# EAGLE design smartbbq (EAGLE 6.6.0)
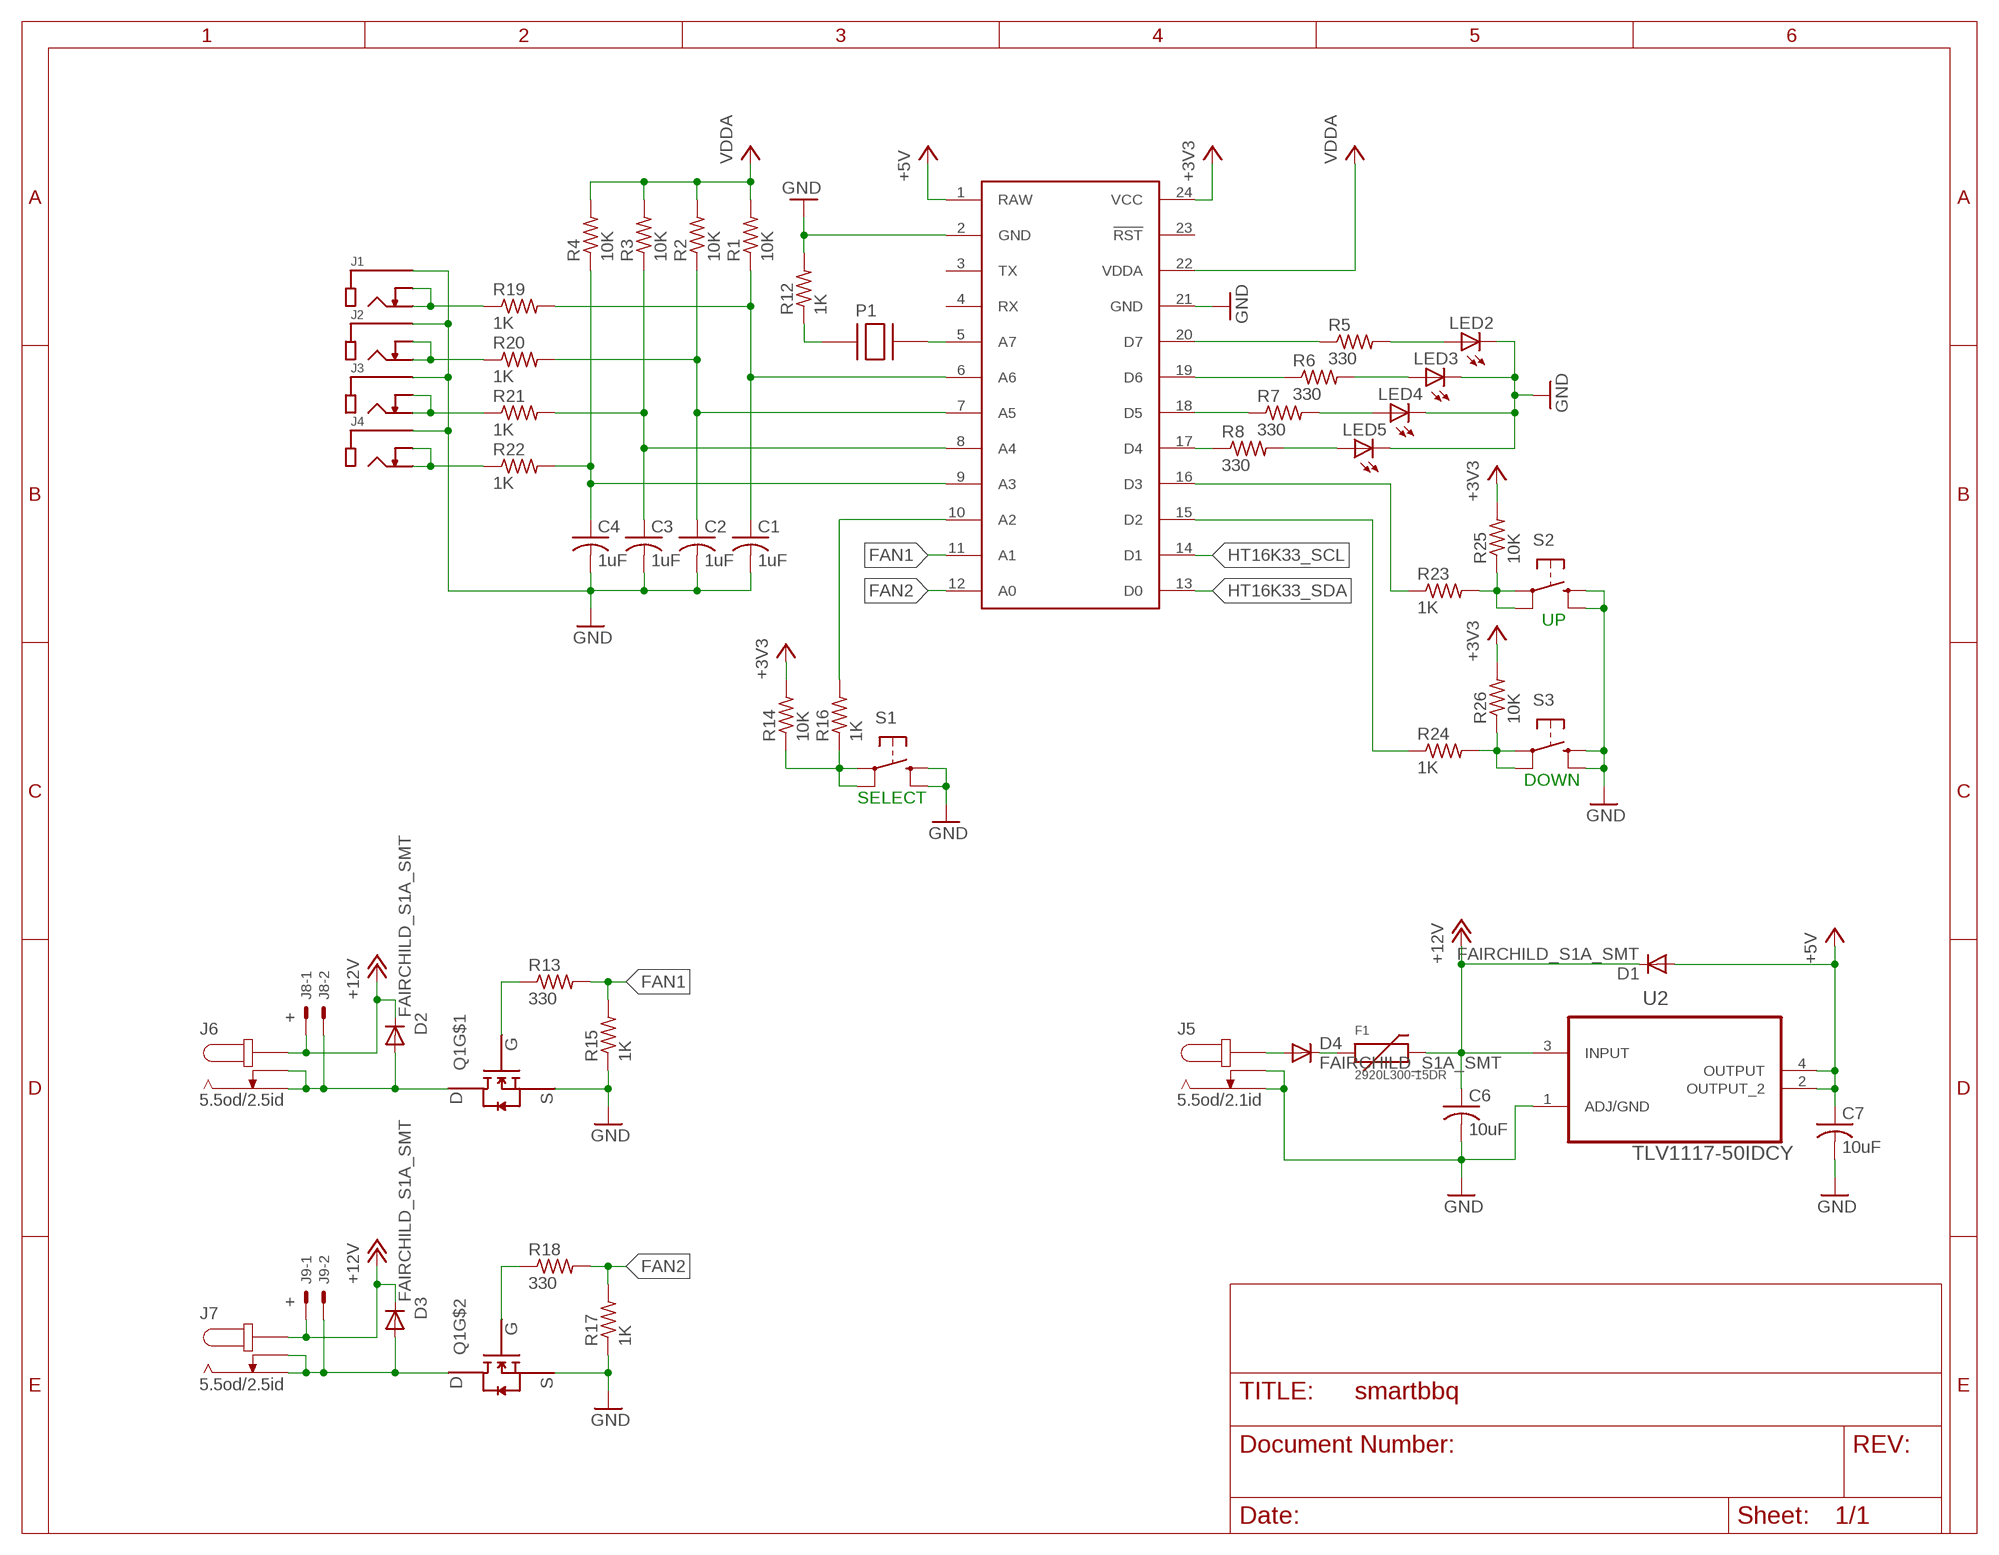
[diagram p0: schematic, sheet 1, part 1 of 2]
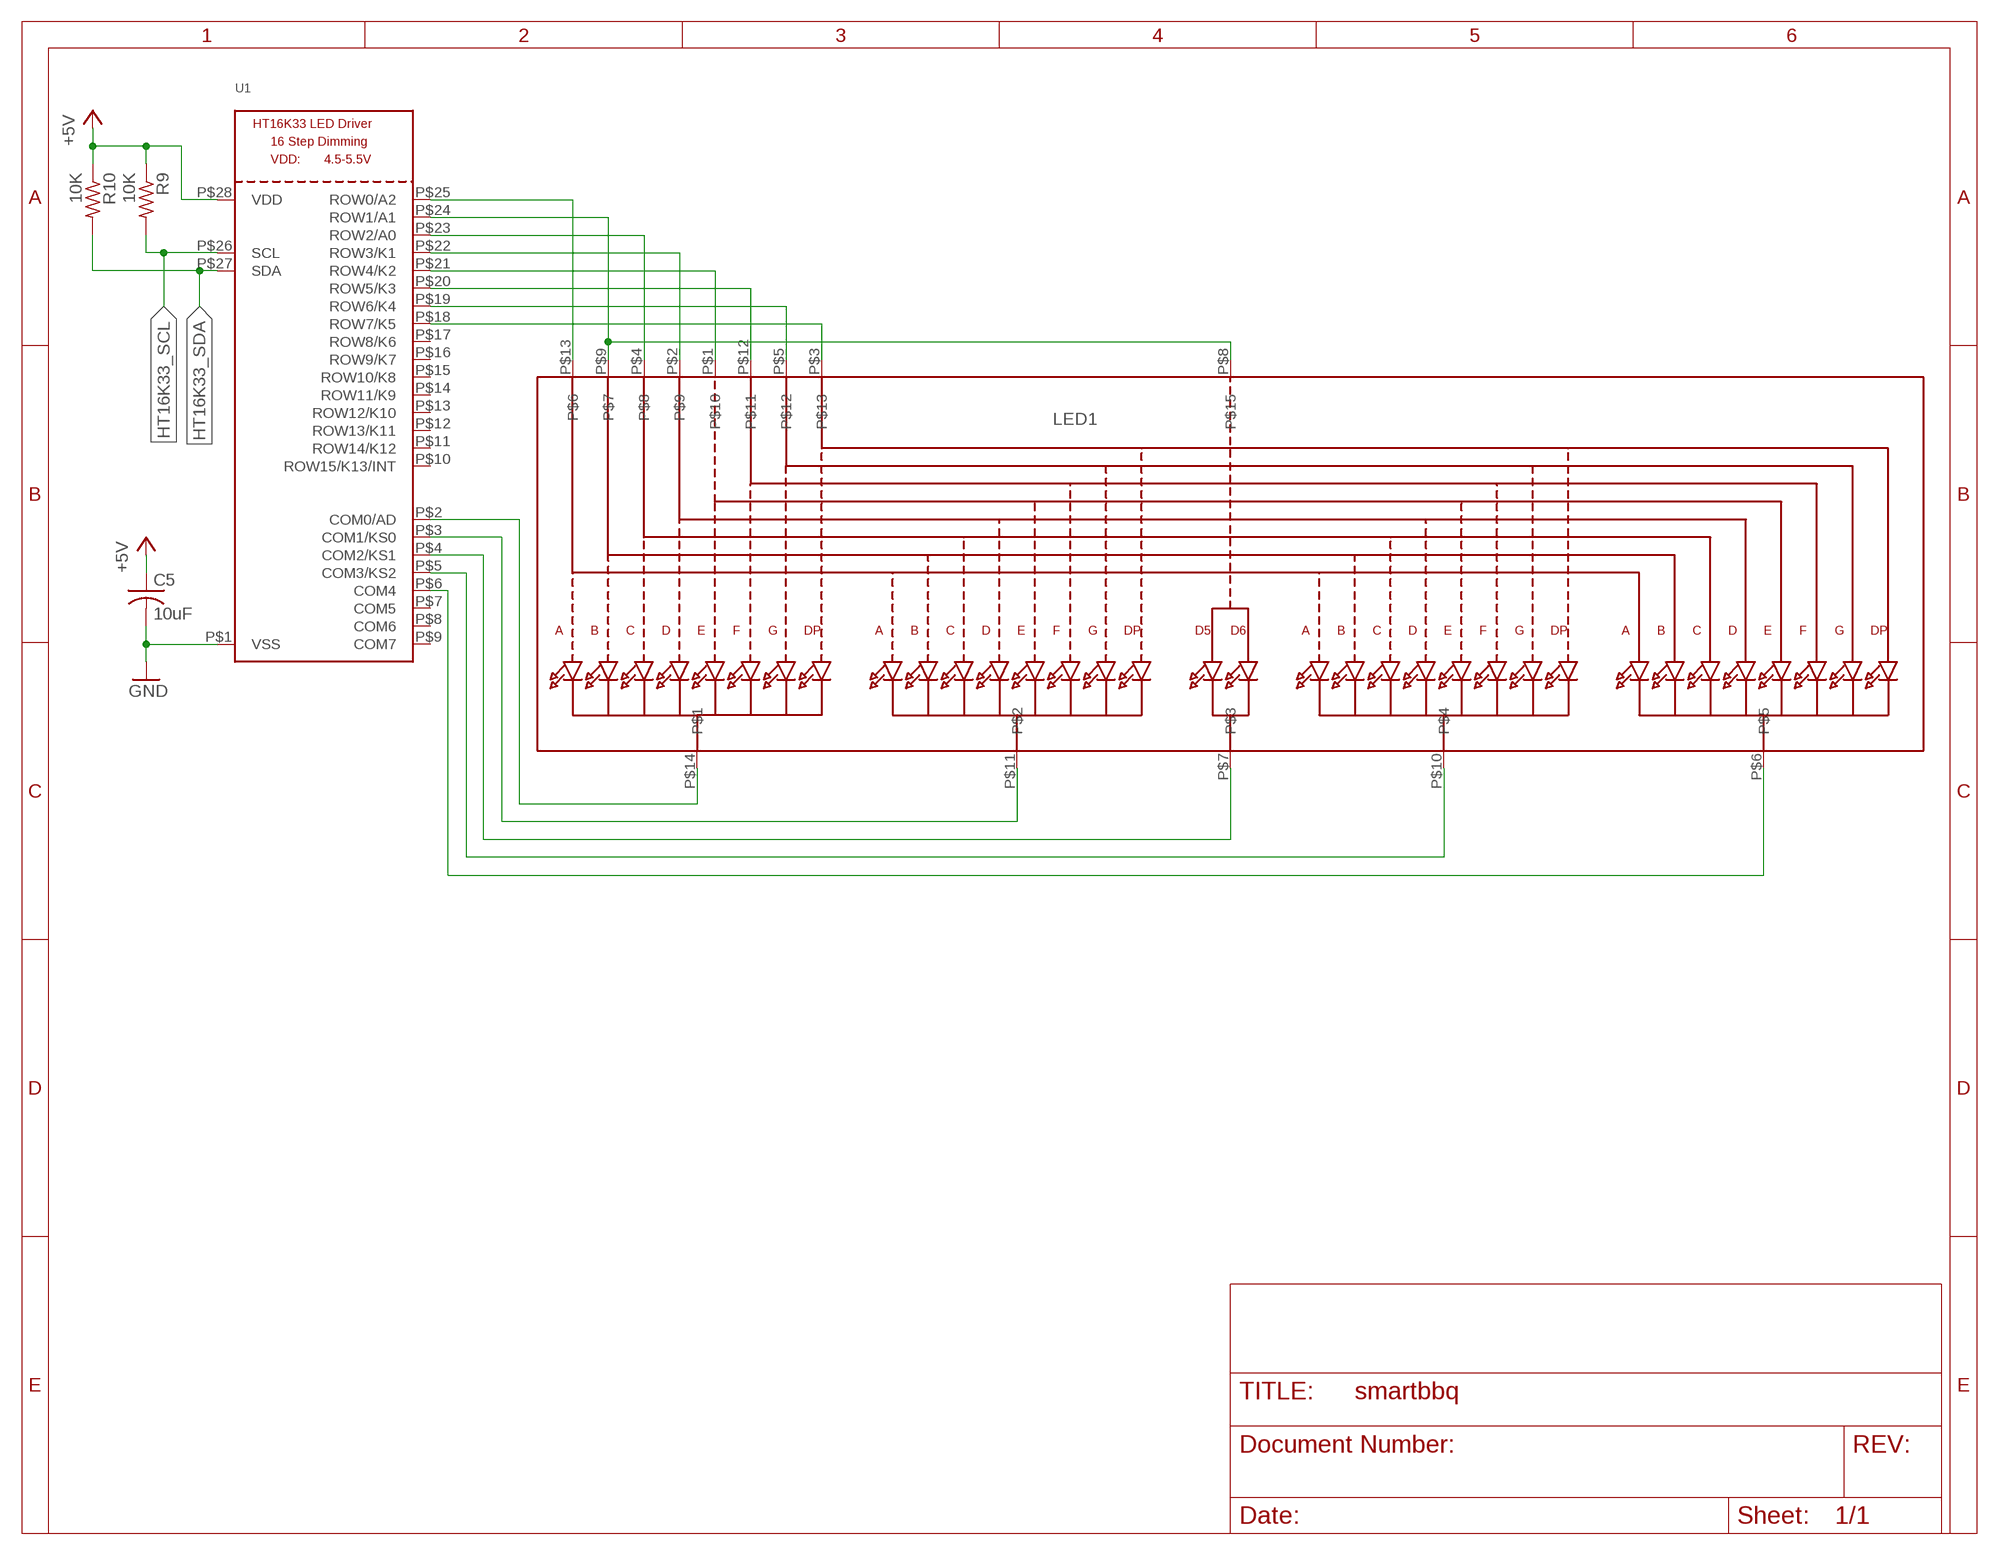
[diagram p1: schematic, sheet 1, part 2 of 2]

## Parts
C1  1uF  C-USC0805  [C0805]
C2  1uF  C-USC0805  [C0805]
C3  1uF  C-USC0805  [C0805]
C4  1uF  C-USC0805  [C0805]
C5  10uF  C-USC0805  [C0805]
C6  10uF  C-USC0805  [C0805]
C7  10uF  C-USC0805  [C0805]
D1  FAIRCHILD_S1A_SMT  [FAIRCHILD_S1A_SMT]
D2  FAIRCHILD_S1A_SMT  [FAIRCHILD_S1A_SMT]
D3  FAIRCHILD_S1A_SMT  [FAIRCHILD_S1A_SMT]
D4  FAIRCHILD_S1A_SMT  [FAIRCHILD_S1A_SMT]
F1  2920L300-15DR  [2920L300-15DR]
J1  MJ_2523_SMT  [MJ_2523_SMT]
J2  MJ_2523_SMT  [MJ_2523_SMT]
J3  MJ_2523_SMT  [MJ_2523_SMT]
J4  MJ_2523_SMT  [MJ_2523_SMT]
J5  5.5od/2.1id  PJ_002AH_SMT  [PJ_002AH_SMT]
J6  5.5od/2.5id  PJ_002AH_SMT  [PJ_002AH_SMT]
J7  5.5od/2.5id  PJ_002AH_SMT  [PJ_002AH_SMT]
J8  +  22-05-7028-02  [7395-02]
J9  +  22-05-7028-02  [7395-02]
LED1  DISP_SEGMENT_4DIGIT_BL-Q56C43  [SEGMENT-BL-Q56C43]
LED2  LEDCHIPLED_0805  [CHIPLED_0805]
LED3  LEDCHIPLED_0805  [CHIPLED_0805]
LED4  LEDCHIPLED_0805  [CHIPLED_0805]
LED5  LEDCHIPLED_0805  [CHIPLED_0805]
P1  CMT_1603_SMT  [CMT_1603_SMT]
Q1  SSM6N58NU  [SSM6N58NU]
R1  10K  R-US_R0805  [R0805]
R2  10K  R-US_R0805  [R0805]
R3  10K  R-US_R0805  [R0805]
R4  10K  R-US_R0805  [R0805]
R5  330  R-US_R0805  [R0805]
R6  330  R-US_R0805  [R0805]
R7  330  R-US_R0805  [R0805]
R8  330  R-US_R0805  [R0805]
R9  10K  R-US_R0805  [R0805]
R10  10K  R-US_R0805  [R0805]
R12  1K  R-US_R0805  [R0805]
R13  330  R-US_R0805  [R0805]
R14  10K  R-US_R0805  [R0805]
R15  1K  R-US_R0805  [R0805]
R16  1K  R-US_R0805  [R0805]
R17  1K  R-US_R0805  [R0805]
R18  330  R-US_R0805  [R0805]
R19  1K  R-US_R0805  [R0805]
R20  1K  R-US_R0805  [R0805]
R21  1K  R-US_R0805  [R0805]
R22  1K  R-US_R0805  [R0805]
R23  1K  R-US_R0805  [R0805]
R24  1K  R-US_R0805  [R0805]
R25  10K  R-US_R0805  [R0805]
R26  10K  R-US_R0805  [R0805]
S1  PANASONIC-EVQ  [PANASONIC-EVQ]
S2  PANASONIC-EVQ  [PANASONIC-EVQ]
S3  PANASONIC-EVQ  [PANASONIC-EVQ]
SPARK  SPARK_CORECORE  [SPARK_CORE]
U1  HT16K33_SOP28  [SOP28_300MIL]
U2  TLV1117-50IDCY  TLV1117-33IDCY  [SOT230P700X180-4N]

## Nets
+3V3: R14.2 R25.2 R26.2 SPARK.24(VCC)
+5V [supply1]: C5.1 C7.1 D1.P$1(A) R9.1 R10.1 SPARK.1(RAW) U1.P$28(VDD) U2.2(OUTPUT_2) U2.4(OUTPUT)
+12V [supply1]: C6.1 D1.P$2(C) D2.P$2(C) D3.P$2(C) F1.P$2 J6.P$1 J6.P$4 J7.P$1 J7.P$4 J8.1 J9.1 U2.3(INPUT)
A0: LED1.P$4 U1.P$23(ROW2/A0)
A1: LED1.P$8 LED1.P$9 U1.P$24(ROW1/A1)
FAN1: R13.2 R15.2 SPARK.11(A1)
FAN2: R17.2 R18.2 SPARK.12(A0)
GND [supply1]: C1.2 C2.2 C3.2 C4.2 C5.2 C6.2 C7.2 J1.P$1 J2.P$1 J3.P$1 J4.P$1 J5.P$2 J5.P$3 LED2.C LED3.C LED4.C LED5.C Q1.P$1 Q1.P$4 R12.2 R15.1 R17.1 S1.P$3 S1.P$4 S2.P$3 S2.P$4 S3.P$3 S3.P$4 SPARK.2(GND) SPARK.21(GND) U1.P$1(VSS) U2.1(ADJ/GND)
HT16K33_SCL: R9.2 SPARK.14(D1) U1.P$26(SCL)
HT16K33_SDA: R10.2 SPARK.13(D0) U1.P$27(SDA)
N$1: LED1.P$14 U1.P$2(COM0/AD)
N$2: LED1.P$11 U1.P$3(COM1/KS0)
N$3: LED1.P$10 U1.P$5(COM3/KS2)
N$4: LED1.P$7 U1.P$4(COM2/KS1)
N$5: R8.1 SPARK.17(D4)
N$6: R7.1 SPARK.18(D5)
N$7: R6.1 SPARK.19(D6)
N$8: R5.1 SPARK.20(D7)
N$9: LED2.A R5.2
N$10: LED3.A R6.2
N$11: LED4.A R7.2
N$12: LED5.A R8.2
N$13: R24.1 SPARK.15(D2)
N$14: R23.1 SPARK.16(D3)
N$15: C1.1 R1.1 R19.2 SPARK.6(A6)
N$16: R16.2 SPARK.10(A2)
N$17: C2.1 R2.1 R20.2 SPARK.7(A5)
N$18: C3.1 R3.1 R21.2 SPARK.8(A4)
N$19: C4.1 R4.1 R22.2 SPARK.9(A3)
N$20: LED1.P$12 U1.P$20(ROW5/K3)
N$21: LED1.P$5 U1.P$19(ROW6/K4)
N$22: LED1.P$6 U1.P$6(COM4)
N$23: LED1.P$2 U1.P$22(ROW3/K1)
N$24: LED1.P$1 U1.P$21(ROW4/K2)
N$25: LED1.P$13 U1.P$25(ROW0/A2)
N$27: LED1.P$3 U1.P$18(ROW7/K5)
N$28: P1.P$1 R12.1
N$29: P1.P$2 SPARK.5(A7)
N$30 [supply1]: D3.P$1(A) J7.P$2 J7.P$3 J9.2 Q1.P$3
N$31: Q1.P$5 R18.1
N$32 [supply1]: D2.P$1(A) J6.P$2 J6.P$3 J8.2 Q1.P$6
N$33 [supply1]: D4.P$2(C) F1.P$1
N$34: Q1.P$2 R13.1
N$35: R14.1 R16.1 S1.P$1 S1.P$2
N$36: J4.P$2 J4.P$3 R22.1
N$37: J3.P$2 J3.P$3 R21.1
N$38: J2.P$2 J2.P$3 R20.1
N$39: J1.P$2 J1.P$3 R19.1
N$40: R23.2 R25.1 S2.P$1 S2.P$2
N$41 [supply1]: D4.P$1(A) J5.P$1 J5.P$4
N$42: R24.2 R26.1 S3.P$1 S3.P$2
VCC: R1.2 R2.2 R3.2 R4.2 SPARK.22(VDDA) ; supply symbol labelled VDDA
Unconnected: SPARK.3(TX) SPARK.4(RX) SPARK.23(!RST) U1.P$7(COM5) U1.P$8(COM6) U1.P$9(COM7) U1.P$10(ROW15/K13/INT) U1.P$11(ROW14/K12) U1.P$12(ROW13/K11) U1.P$13(ROW12/K10) U1.P$14(ROW11/K9) U1.P$15(ROW10/K8) U1.P$16(ROW9/K7) U1.P$17(ROW8/K6)

## Notes on the sheet
- UP
- DOWN
- SELECT

## Library data of the parts
C1-C7 = rcl:C-US: CAPACITOR, American symbol
D1-D4 = engirati:FAIRCHILD_S1A_SMT
F1 = engirati:2920L300-15DR
J1-J4 = engirati:MJ_2523_SMT
J5-J7 = engirati:PJ_002AH_SMT: MODEL: PJ-002AH-SMT or PJ-002BH-SMT DESCRIPTION: DC POWER JACK FEATURES: high current rating: 5A internal switch RoHS compliant
J8 J9 = con-molex:22-?-02: CONNECTOR wire to board 2.54 mm (.1 inch) pitch header; OC_FARNELL: 9731601; OC_NEWARK: unknown
LED1 = microbuilder:DISP_SEGMENT_4DIGIT_BL-Q56C43
LED2-LED5 = led:LED: LED OSRAM: - CHIPLED LG R971, LG N971, LY N971, LG Q971, LY Q971, LO R971, LY R971 LH N974, LH R974 LS Q976, LO Q976, LY Q976 LO Q996 - Hyper CHIPLED LW Q18S LB Q993, LB Q99A, LB R99A - SideLED LS A670, LO A670, LY A670, LG A670, LP A670 LB A673, LV A673, LT A673, LW A673 LH A674 LY A675 LS A676, LA A676, LO A676, LY A676, LW A676 LS A679, LY A679, LG A679 - Hyper Micro SIDELED® LS Y876, LA Y876, LO Y876, LY Y876 LT Y87S - SmartLED LW L88C, LW L88S LB L89C, LB L89S, LG L890 LS L89K, LO L89K, LY L89K LS L896, LA L896, LO L896, LY L896 - TOPLED LS T670, LO T670, LY T670, LG T670, LP T670 LSG T670, LSP T670, LSY T670, LOP T670, LYG T670 LG T671, LOG T671, LSG T671 LB T673, LV T673, LT T673, LW T673 LH T674 LS T676, LA T676, LO T676, LY T676, LB T676, LH T676, LSB T676, LW T676 LB T67C, LV T67C, LT T67C, LS T67K, LO T67K, LY T67K, LW E67C LS E67B, LA E67B, LO E67B, LY E67B, LB E67C, LV E67C, LT E67C LW T67C LS T679, LY T679, LG T679 LS T770, LO T770, LY T770, LG T770, LP T770 LB T773, LV T773, LT T773, LW T773 LH T774 LS E675, LA E675, LY E675, LS T675 LS T776, LA T776, LO T776, LY T776, LB T776 LHGB T686 LT T68C, LB T68C - Hyper Mini TOPLED® LB M676 - Mini TOPLED Santana® LG M470 LS M47K, LO M47K, LY M47K Source: http://www.osram.convergy.de LUXEON: - LUMILED® LXK2-PW12-R00, LXK2-PW12-S00, LXK2-PW14-U00, LXK2-PW14-V00 LXK2-PM12-R00, LXK2-PM12-S00, LXK2-PM14-U00 LXK2-PE12-Q00, LXK2-PE12-R00, LXK2-PE12-S00, LXK2-PE14-T00, LXK2-PE14-U00 LXK2-PB12-K00, LXK2-PB12-L00, LXK2-PB12-M00, LXK2-PB14-N00, LXK2-PB14-P00, LXK2-PB14-Q00 LXK2-PR12-L00, LXK2-PR12-M00, LXK2-PR14-Q00, LXK2-PR14-R00 LXK2-PD12-Q00, LXK2-PD12-R00, LXK2-PD12-S00 LXK2-PH12-R00, LXK2-PH12-S00 LXK2-PL12-P00, LXK2-PL12-Q00, LXK2-PL12-R00 Source: www.luxeon.com KINGBRIGHT: KA-3528ASYC Source: www.kingbright.com
P1 = engirati:CMT_1603_SMT
Q1 = engirati:SSM6N58NU
R1-R10 R12-R26 = rcl:R-US_: RESISTOR, American symbol
S1-S3 = engirati:PANASONIC-EVQ
SPARK = Spark:SPARK_CORE
U1 = microbuilder:HT16K33_SOP28
U2 = Texas Instruments_By_element14_Batch_1:TLV1117-33IDCY: V REG, LDO, 3.3V, 0.8A; MPN: TLV1117-33IDCY; OC_FARNELL: 1703385; OC_NEWARK: 67K8522; PACKAGE: SOT-223-3; SUPPLIER: TEXAS INSTRUMENTS

## Net classes
0 default: width 0.254 mm, drill 0.203 mm, clearance 0.203 mm
1 supply1: width 0.457 mm, drill 0.508 mm, clearance 0.203 mm

## Board
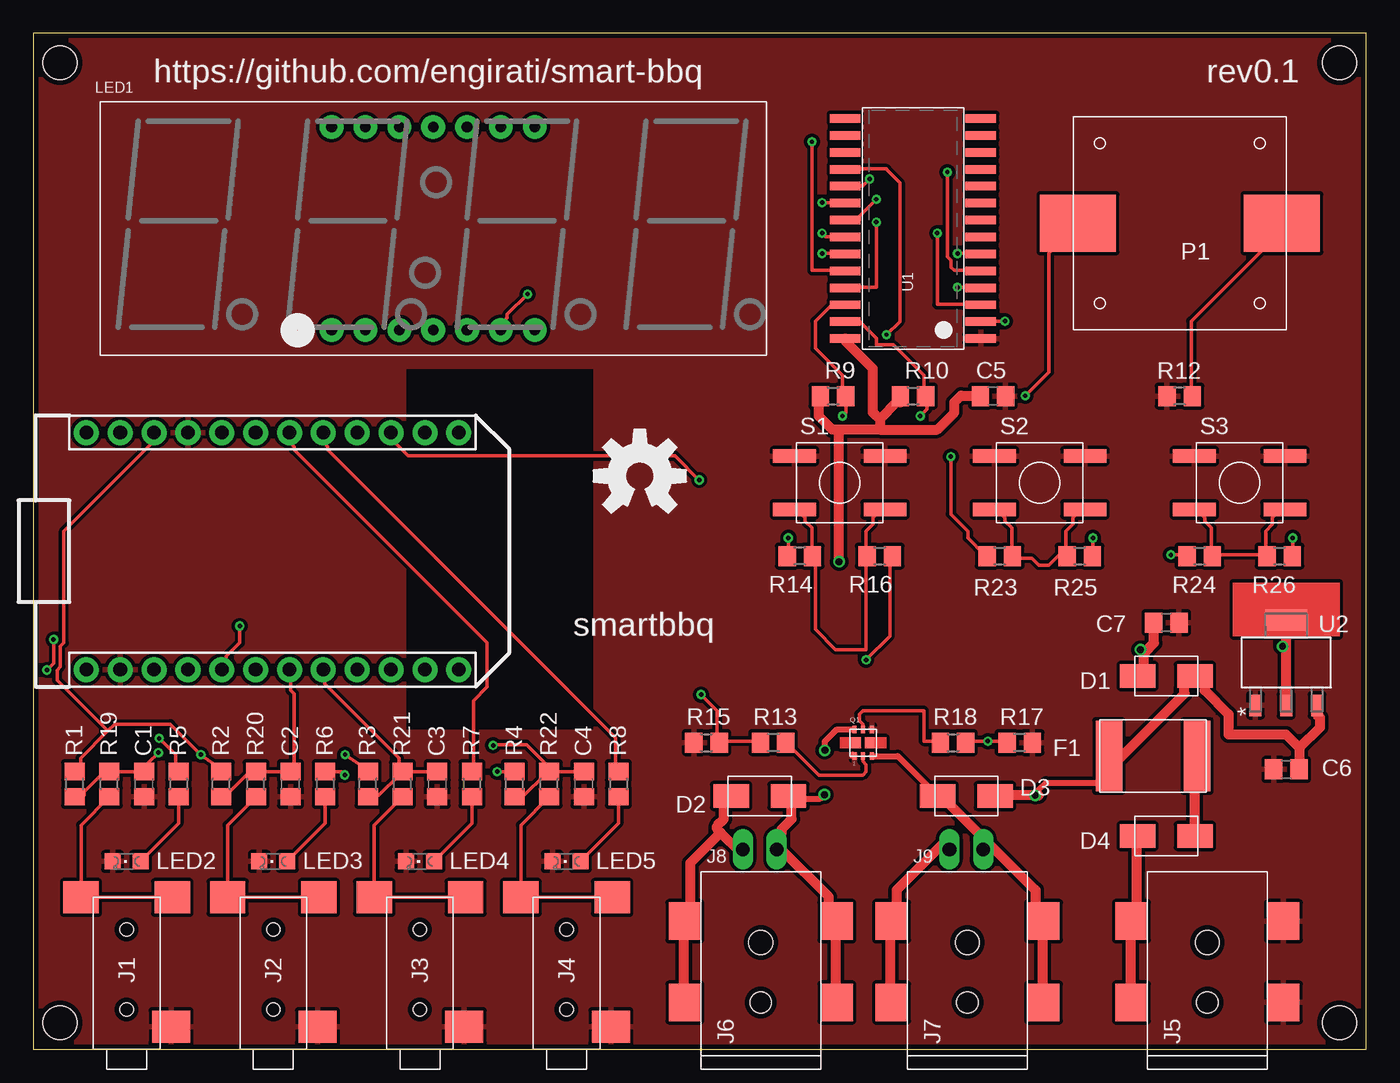
[diagram p2: board, top side]
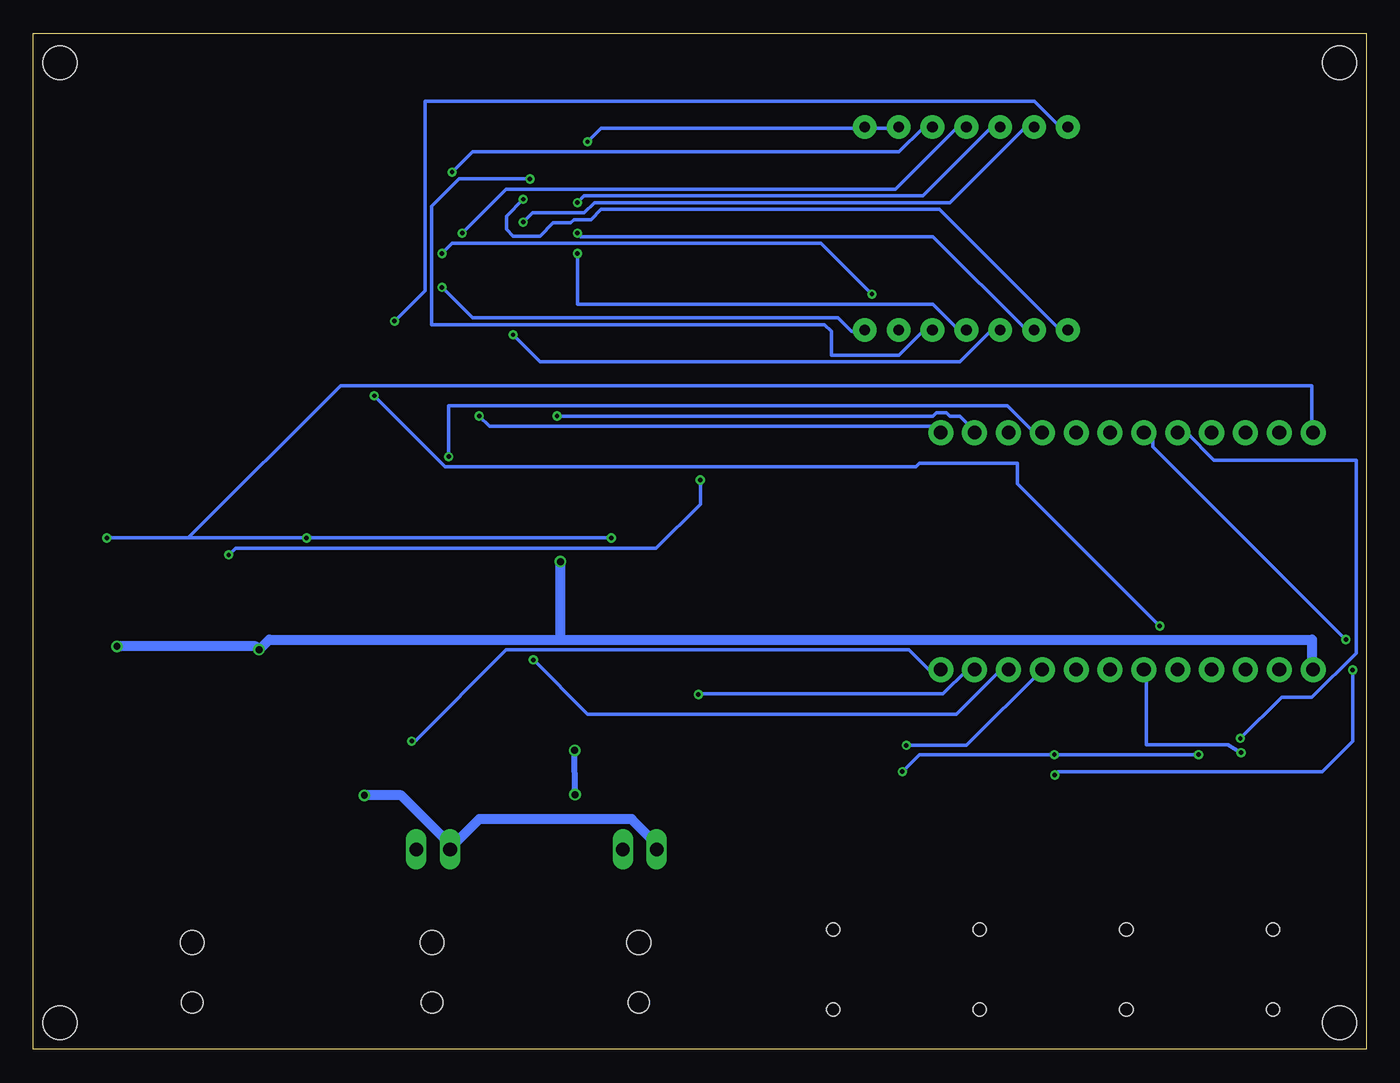
[diagram p3: board, bottom side, seen from below]

Size 100 x 76.2 mm. Coordinates in mm from the lower left corner, seen from the top.
Outline: 0,0 100,0 100,76.2 0,76.2 0,0
Copper layers (1*16): Top 0.0356mm / dielectric 1.5011mm / Bottom 0.0356mm
Design rules "LaenPCBOrder": minimum track width 6mil, minimum drill 13mil, track to track 6mil, track to pad 6mil, pad to pad 6mil, via to via 6mil, smd to smd 6mil, copper to edge 15mil, drill to drill 6mil, minimum pad ring 7mil, minimum via ring 7mil, stop-mask expansion 3mil, vias tented up to drill 0mil, thermal gap 10mil
Holes 2.54 mm at 2,2 2,74 98,74 98,2
tRestrict: area 28,24 to 42,51

### Footprints (pad centres in the part's own frame; a part is rotated, then mirrored left to right if it is on the bottom)
C0805 = smd 1.3 x 1.5: 1 -0.95,0; 2 0.95,0
FAIRCHILD_S1A_SMT = smd 2.65 x 1.75: P$1 -2.15,0; P$2 2.15,0
2920L300-15DR = smd 2 x 5.3: P$1 -3.3,0; P$2 3.3,0
MJ_2523_SMT = smd 2.4 x 2.85: P$1 1.7,-0.825 | smd 2.4 x 2.65: P$2 11.4,-0.925; P$3 11.4,5.925 | hole 1: 3,2.5; 9,2.5
PJ_002AH_SMT = smd 2.8 x 2.4: P$1 -1.985,5.615; P$2 -1.985,-5.785; P$3 4.115,-5.785; P$4 4.115,5.615 | hole 1.6: -1.985,-0.085 | hole 1.8: 2.515,-0.085
7395-02 = drill 1.016 long: 1 1.27,0; 2 -1.27,0
SEGMENT-BL-Q56C43 = drill 0.8 pad 1.778: P$1 -7.62,-7.62; P$2 -5.08,-7.62; P$3 -2.54,-7.62; P$4 0,-7.62; P$5 2.54,-7.62; P$6 5.08,-7.62; P$7 7.62,-7.62; P$8 7.62,7.62; P$9 5.08,7.62; P$10 2.54,7.62; P$11 0,7.62; P$12 -2.54,7.62; P$13 -5.08,7.62; P$14 -7.62,7.62
CHIPLED_0805 = smd 1.2 x 1.2: A 0,-1.05; C 0,1.05
CMT_1603_SMT = smd 5.7 x 4.3: P$1 -7.67,0.045; P$2 7.63,0.045
SSM6N58NU = smd 0.3 x 0.55: P$1 -0.65,-1; P$2 0,-1; P$3 0.65,-1; P$4 0.65,1; P$5 0,1; P$6 -0.65,1 | smd 0.75 x 0.8: P$7 -0.525,0; P$8 0.525,0
R0805 = smd 1.3 x 1.5: 1 -0.95,0; 2 0.95,0
PANASONIC-EVQ = smd 3.2 x 1: P$1 -3.4,-2; P$2 3.4,-2; P$3 -3.4,2; P$4 3.4,2
SPARK_CORE = drill 1.016 pad 1.88: 1 -8.89,13.97; 2 -8.89,11.43; 3 -8.89,8.89; 4 -8.89,6.35; 5 -8.89,3.81; 6 -8.89,1.27; 7 -8.89,-1.27; 8 -8.89,-3.81; 9 -8.89,-6.35; 10 -8.89,-8.89; 11 -8.89,-11.43; 12 -8.89,-13.97; 13 8.89,-13.97; 14 8.89,-11.43; 15 8.89,-8.89; 16 8.89,-6.35; 17 8.89,-3.81; 18 8.89,-1.27; 19 8.89,1.27; 20 8.89,3.81; 21 8.89,6.35; 22 8.89,8.89; 23 8.89,11.43; 24 8.89,13.97
SOP28_300MIL = smd 0.635 x 2.286: P$1 -8.255,-5.08; P$2 -6.985,-5.08; P$3 -5.715,-5.08; P$4 -4.445,-5.08; P$5 -3.175,-5.08; P$6 -1.905,-5.08; P$7 -0.635,-5.08; P$8 0.635,-5.08; P$9 1.905,-5.08; P$10 3.175,-5.08; P$11 4.445,-5.08; P$12 5.715,-5.08; P$13 6.985,-5.08; P$14 8.255,-5.08; P$15 8.255,5.08; P$16 6.985,5.08; P$17 5.715,5.08; P$18 4.445,5.08; P$19 3.175,5.08; P$20 1.905,5.08; P$21 0.635,5.08; P$22 -0.635,5.08; P$23 -1.905,5.08; P$24 -3.175,5.08; P$25 -4.445,5.08; P$26 -5.715,5.08; P$27 -6.985,5.08; P$28 -8.255,5.08
SOT230P700X180-4N = smd 1.626 x 0.889: 1 -3.2,2.311; 2 -3.2,0; 3 -3.2,-2.311 | smd 1.626 x 3.175: 4 3.2,0

### Placement (x,y rotation side)
C1  8.3,19.9 270 top
C2  19.3,19.9 270 top
C3  30.3,19.9 270 top
C4  41.3,19.9 270 top
C5  72,49 0 top
C6  94,21 180 top
C7  85,32 0 top
D1  85,28 0 top
D2  54.5,19 180 top
D3  70,19 0 top
D4  85,16 0 top
F1  84,22 180 top
J1  9.5,0 90 top
J2  20.5,0 90 top
J3  31.5,0 90 top
J4  42.5,0 90 top
J5  88,5.5 90 top
J6  54.5,5.5 90 top
J7  70,5.5 90 top
J8  54.5,15 180 top
J9  70,15 180 top
LED1  30,61.56 0 top
LED2  7,14.1 90 top
LED3  18,14.1 90 top
LED4  29,14.1 90 top
LED5  40,14.1 90 top
P1  86,62 180 top
Q1  62.25,23 0 top
R1  3.1,19.9 90 top
R2  14.1,19.9 90 top
R3  25.1,19.9 90 top
R4  36.1,19.9 90 top
R5  10.9,19.9 270 top
R6  21.9,19.9 270 top
R7  32.9,19.9 270 top
R8  43.9,19.9 270 top
R9  60,49 0 top
R10  66,49 0 top
R12  86,49 180 top
R13  55.5,23 180 top
R14  57.5,37 180 top
R15  50.5,23 0 top
R16  63.5,37 0 top
R17  74,23 180 top
R18  69,23 0 top
R19  5.7,19.9 90 top
R20  16.7,19.9 90 top
R21  27.7,19.9 90 top
R22  38.7,19.9 90 top
R23  72.5,37 0 top
R24  87.5,37 0 top
R25  78.5,37 0 top
R26  93.5,37 0 top
S1  60.5,42.5 0 top
S2  75.5,42.5 0 top
S3  90.5,42.5 0 top
SPARK  17.95,37.37 90 top
U1  66,61.56 90 top
U2  94,29 90 top
U$1  [OSHW-LOGO-L]  45.5,43 0 top

### Tracks (layer width: path | path; a pad name or v marks a point on that pad's centre or on a via)
+3V3  (via drill 0.33)
  Top 0.254: v56.64,38.35 56.64,37.08 R14.2 | v79.5,38.35 79.5,37.08 R25.2 | v94.49,38.35 94.49,37.08 R26.2
  Bottom 0.254: v56.64,38.35 v79.5,38.35 88.39,38.35 | 88.39,38.35 v94.49,38.35 | 88.39,38.35 76.96,49.78 4.06,49.78 4.06,46.48 SPARK.24
+5V  (via drill 0.51)
  Top 0.762: 63.5,46.48 60.45,46.48 | 60.45,46.48 59.94,46.48 58.93,47.5 58.93,48.77 R9.1 | 63.5,47.24 63.5,46.48 | 63.5,47.24 64.77,48.51 65.02,48.51 65.02,48.77 R10.1 | 63.5,46.48 67.82,46.48 69.09,47.75 69.09,48.51 69.6,49.02 70.87,49.02 C5.1 | U1.P$28 60.96,53.09 62.99,51.05 62.99,47.75 63.5,47.24 | 93.98,30.23 93.98,32 U2.4 | 93.98,30.23 93.98,25.91 U2.2 | 83.31,29.72 84.07,30.48 84.07,31.75 C7.1 | 83.31,29.72 83.31,28.45 83.06,28.19 D1.P$1 | v83.06,29.97 83.31,29.72 | v93.73,30.23 93.98,30.23 | v60.45,36.58 60.45,46.48
  Bottom 0.762: 60.45,30.73 82.3,30.73 v83.06,29.97 83.31,30.23 v93.73,30.23 | 60.45,30.73 4.06,30.73 4.06,28.7 SPARK.1 | 60.45,30.73 v60.45,36.58
+12V  (via drill 0.51)
  Top 0.457: 75.42,19.05 75.42,19.42 76,20 80.71,20 80.77,20.07
  Top 0.762: 95,22.61 95,21.08 C6.1 | 95,22.61 96.52,24.13 96.52,24.89 96.27,25.15 96.27,25.65 U2.3 | 75.42,19.05 v75.17,19.05 72.39,19.05 D3.P$2 | 80.77,20.07 80.77,21.84 F1.P$2 81.03,21.34 86.36,26.67 86.36,27.94 87.12,27.94 D1.P$2 87.38,28.19 87.88,27.69 87.88,26.92 89.66,25.15 89.66,23.62 93.98,23.62 95,22.61 | J7.P$1 64.26,3.56 64.26,9.4 J7.P$4 64.52,9.91 64.77,10.16 64.77,11.94 68.58,15.75 68.83,15.75 68.83,15.24 J9.1 | J6.P$1 48.77,3.56 48.77,9.4 J6.P$4 49.02,9.91 49.28,10.16 49.28,13.97 51.56,16.26 | 51.56,16.26 53.09,14.73 53.34,14.73 53.34,14.99 J8.1 | 51.56,16.26 51.31,16.51 51.31,16.76 51.82,17.27 51.82,18.29 52.32,18.8 D2.P$2
  Bottom 0.762: J8.1 53.09,15.24 55.12,17.27 66.55,17.27 68.58,15.24 J9.1 68.83,15.49 72.39,19.05 v75.17,19.05
A0  (via drill 0.33)
  Top 0.254: v59.18,59.69 60.71,59.69 U1.P$23
  Bottom 0.254: v59.18,59.69 59.18,55.88 32.51,55.88 30.48,53.85 30.23,53.85 LED1.P$4
A1  (via drill 0.33)
  Top 0.254: v58.42,68.07 58.42,58.42 60.71,58.42 U1.P$24
  Bottom 0.254: v58.42,68.07 57.4,69.09 37.85,69.09 LED1.P$8 37.59,69.09 35.31,69.09 LED1.P$9
FAN1  (via drill 0.33)
  Top 0.254: R13.2 54.36,23.11 51.56,23.11 R15.2 51.31,23.11 51.31,25.4 v50.1,26.61
  Bottom 0.254: v50.1,26.61 50.04,26.67 31.75,26.67 29.97,28.45 29.46,28.45 SPARK.11
FAN2  (via drill 0.33)
  Top 0.254: R17.2 72.9,23.11 v71.61,23.11 70.1,23.11 R18.2
  Bottom 0.254: SPARK.12 32,28.45 32.77,28.45 34.29,29.97 64.52,29.97 71.37,23.11 v71.61,23.11
GND
  Top 0.457: Q1.P$1 61.47,22.1 61.47,22 | SPARK.21 11.68,45.72 11.55,45.72
  pour Top: -1,77 -1,-1 101,-1 101,77
HT16K33_SCL  (via drill 0.33)
  Top 0.254: U1.P$26 60.71,55.88 59.94,55.88 58.67,54.61 58.67,52.58 60.71,50.55 60.71,49.02 R9.2 60.96,48.77 60.96,47.75 v60.71,47.5
  Bottom 0.254: v60.71,47.5 32.51,47.5 32.26,47.75 31.5,47.75 31.24,47.5 30.48,47.5 29.46,46.48 SPARK.14
HT16K33_SDA  (via drill 0.33)
  Top 0.254: U1.P$27 60.96,54.61 61.98,54.61 63.25,53.34 63.25,52.83 64.52,52.83 66.8,50.55 66.8,49.02 R10.2 67.06,48.77 67.06,48.01 v66.55,47.5
  Bottom 0.254: v66.55,47.5 65.79,46.74 32.26,46.74 32,46.48 SPARK.13
N$1  (via drill 0.33)
  Top 0.254: v72.9,54.61 71.12,54.61 U1.P$2
  Bottom 0.254: v72.9,54.61 70.61,56.9 70.61,71.12 24.89,71.12 22.86,69.09 22.61,69.09 LED1.P$14
N$2  (via drill 0.33)
  Top 0.254: v67.82,61.21 67.82,55.88 70.87,55.88 U1.P$3
  Bottom 0.254: v67.82,61.21 64.52,64.52 35.31,64.52 30.73,69.09 30.23,69.09 LED1.P$11
N$3  (via drill 0.33)
  Top 0.254: v68.58,65.79 68.58,59.44 68.83,59.18 68.83,58.67 69.09,58.42 70.87,58.42 U1.P$5
  Bottom 0.254: v68.58,65.79 67.06,67.31 35.05,67.31 33.27,69.09 32.77,69.09 LED1.P$10
N$4  (via drill 0.33)
  Top 0.254: v69.34,57.15 70.87,57.15 U1.P$4
  Bottom 0.254: v69.34,57.15 67.06,54.86 39.62,54.86 38.61,53.85 37.85,53.85 LED1.P$7
N$5
  Top 0.254: R8.1 43.69,21.08 43.69,23.37 22.1,44.96 22.1,45.21 21.84,45.47 21.84,46.23 SPARK.17
N$6
  Top 0.254: R7.1 33.02,21.08 33.02,26.16 34.04,27.18 34.04,30.48 19.56,44.96 19.56,45.21 19.3,45.47 19.3,46.23 SPARK.18
N$7  (via drill 0.33)
  Top 0.254: v23.37,20.57 23.11,20.83 22.1,20.83 R6.1 | v1.02,28.45 1.52,28.96 v1.52,30.73
  Bottom 0.254: v23.37,20.57 23.11,20.83 3.3,20.83 1.02,23.11 v1.02,28.45 | v1.52,30.73 16,45.21 16,46.23 16.51,46.23 SPARK.19
N$8  (via drill 0.33)
  Top 0.254: v9.44,23.32 10.67,22.1 10.67,21.08 R5.1
  Bottom 0.254: v9.44,23.32 6.35,26.42 4.06,26.42 0.76,29.72 0.76,44.2 11.43,44.2 13.46,46.23 13.97,46.23 SPARK.20
N$9
  Top 0.254: 8.13,14.22 LED2.A 10.9,16.95 R5.2
N$10
  Top 0.254: R6.2 21.9,16.95 LED3.A
N$11
  Top 0.254: R7.2 32.9,16.95 LED4.A
N$12
  Top 0.254: 41.15,14.1 LED5.A 43.9,16.95 R8.2
N$13  (via drill 0.33)
  Top 0.254: v85.34,37.08 86.36,37.08 R24.1 | SPARK.15 26.92,46.23 26.92,45.72 28.12,44.53 48.13,44.53 v49.96,42.7
  Bottom 0.254: v85.34,37.08 84.84,37.59 53.26,37.59 49.96,40.89 v49.96,42.7
N$14  (via drill 0.33)
  Top 0.254: v68.83,44.45 68.83,40.13 70.1,38.86 70.1,38.35 71.37,37.08 R23.1
  Bottom 0.254: v68.83,44.45 68.83,48.26 26.92,48.26 24.89,46.23 24.38,46.23 SPARK.16
N$15  (via drill 0.33)
  Top 0.254: R1.1 3.3,19.05 3.81,19.05 3.81,19.3 5.59,21.08 R19.2 5.84,20.83 8.13,20.83 C1.1 8.38,21.08 8.64,21.34 8.64,21.5 v9.39,22.25
  Bottom 0.254: v9.39,22.25 10.4,22.86 16.51,22.86 16.51,28.45 SPARK.6
N$16  (via drill 0.33)
  Top 0.254: v62.48,29.21 64.26,30.99 64.26,36.83 R16.2
  Bottom 0.254: v62.48,29.21 58.42,25.15 30.73,25.15 27.43,28.45 26.92,28.45 SPARK.10
N$17
  Top 0.254: R2.1 14.22,19.05 14.73,19.05 14.73,19.3 16.51,21.08 R20.2 16.76,20.83 19.05,20.83 C2.1 19.3,21.08 19.56,21.34 19.56,26.67 19.3,26.92 19.3,28.45 SPARK.7
N$18
  Top 0.254: 27.43,20.57 27.69,20.83 R21.2 | 27.43,20.57 25.91,19.05 25.15,19.05 R3.1 | C3.1 30.23,20.83 27.94,20.83 R21.2 | 27.43,20.57 27.43,21.84 21.84,27.43 21.84,28.45 SPARK.8 | 27.43,20.57 R21.2
N$19  (via drill 0.33)
  Top 0.254: 38.35,20.57 38.61,20.83 R22.2 | 38.35,20.57 36.83,19.05 36.32,19.05 R4.1 | C4.1 41.15,20.83 38.86,20.83 R22.2 | 38.35,20.57 R22.2 | 38.35,20.57 38.35,21.51 37,22.86 34.56,22.86 v34.5,22.8 34.66,22.86
  Bottom 0.254: 24.38,28.45 SPARK.9 29.98,22.8 v34.5,22.8
N$20  (via drill 0.33)
  Top 0.254: v59.18,63.5 60.71,63.5 U1.P$20
  Bottom 0.254: v59.18,63.5 58.67,64.01 33.27,64.01 28.19,69.09 27.69,69.09 LED1.P$12
N$21  (via drill 0.33)
  Top 0.254: v62.74,65.28 62.23,64.77 60.96,64.77 U1.P$19
  Bottom 0.254: v62.74,65.28 68.07,65.28 70.1,63.25 70.1,54.36 40.64,54.36 40.13,53.85 40.13,52.07 35.05,52.07 33.27,53.85 32.77,53.85 LED1.P$5
N$22  (via drill 0.33)
  Top 0.254: v69.34,59.69 70.87,59.69 U1.P$6 | v37.08,56.64 35.56,55.12 35.56,54.86 35.05,54.36 35.05,54.1 LED1.P$6
  Bottom 0.254: v69.34,59.69 68.58,60.45 40.89,60.45 v37.08,56.64
N$23  (via drill 0.33)
  Top 0.254: v59.18,61.21 59.44,60.96 60.71,60.96 U1.P$22
  Bottom 0.254: v59.18,61.21 58.93,60.96 32.51,60.96 25.4,53.85 25.15,53.85 LED1.P$2
N$24  (via drill 0.33)
  Top 0.254: v63.25,63.75 61.98,62.48 61.98,62.23 60.96,62.23 U1.P$21
  Bottom 0.254: v63.25,63.75 64.5,62.5 64.5,61.5 64,61 62,61 61.02,61.98 59.69,61.98 59.44,62.23 58.17,62.23 57.4,62.99 32,62.99 22.86,53.85 22.61,53.85 LED1.P$1
N$25  (via drill 0.33)
  Top 0.254: v63.25,62.04 63.25,57.15 60.96,57.15 U1.P$25
  Bottom 0.254: LED1.P$13 25.15,69.09 25.65,69.09 31.24,63.5 57.91,63.5 58.67,62.74 62.55,62.74 v63.25,62.04
N$27  (via drill 0.33)
  Top 0.254: U1.P$18 60.96,66.04 64.01,66.04 64.01,65.99 65,65 65,54.59 v64.01,53.59
  Bottom 0.254: v64.01,53.59 61.98,51.56 30.48,51.56 28.19,53.85 27.69,53.85 LED1.P$3
N$28
  Top 0.254: R12.1 86.87,49.02 86.87,54.61 93.47,61.21 93.47,61.72 P1.P$1
N$29  (via drill 0.33)
  Top 0.254: v15.49,31.75 15.49,30.48 14.48,29.46 14.48,28.96 14.22,28.7 SPARK.5 | v74.42,49.02 76.2,50.8 76.2,59.69 78.23,61.72 P1.P$2
  Bottom 0.254: v15.49,31.75 26.16,42.42 26.16,43.94 33.53,43.94 33.78,43.69 69.09,43.69 v74.42,49.02
N$30
  Top 0.457: Q1.P$3 64.85,22 D3.P$1
  Top 0.762: J7.P$2 75.69,3.56 75.69,9.4 J7.P$3 75.69,9.91 75.18,10.41 75.18,11.94 71.63,15.49 J9.2 71.37,15.24 71.37,15.75 68.58,18.54 68.58,19.05 68.07,19.05 D3.P$1
N$31
  Top 0.254: Q1.P$5 62.23,24.13 62.23,24.38 61.98,24.64 61.98,25.15 62.23,25.4 66.8,25.4 66.8,23.11 67.82,23.11 R18.1
N$32  (via drill 0.51 pad 0.25)
  Top 0.457: v59.38,22.43 59.38,23.09 60.3,24 Q1.P$6 | 56.9,18.8 59.05,18.8 v59.36,19.1
  Top 0.762: D2.P$1 56.9,18.8 56.9,17.27 56.13,16.51 56.13,16.26 55.88,16 55.88,15.24 J8.2 56.13,14.99 59.69,11.43 59.69,10.67 60.2,10.16 60.2,9.91 J6.P$3 60.2,9.4 60.2,3.56 J6.P$2
  Bottom 0.457: v59.36,19.1 v59.38,22.43
N$33
  Top 0.762: D4.P$2 87.12,16 87.12,20.83 87.38,21.08 87.38,21.84 F1.P$1
N$34
  Top 0.254: Q1.P$2 62.23,21.84 62.23,21.59 62.48,21.34 62.48,20.83 62.23,20.57 58.93,20.57 56.64,22.86 R13.1
N$35
  Top 0.254: S1.P$1 57.15,40.64 57.91,39.88 57.91,39.62 58.42,39.12 58.42,37.08 R14.1 58.67,36.83 58.67,31.5 60.2,29.97 62.48,29.97 62.48,36.83 R16.1 62.48,37.08 62.48,38.86 62.99,39.37 62.99,39.88 63.75,40.64 S1.P$2
N$36
  Top 0.254: R22.1 36.58,16.82 J4.P$3 J4.P$2
N$37
  Top 0.254: 32.26,11.43 J3.P$2 J3.P$3 25.57,16.82 R21.1
N$38
  Top 0.254: R20.1 14.57,16.82 J2.P$3 J2.P$2
N$39
  Top 0.254: J1.P$2 J1.P$3 3.58,16.82 R19.1
N$40
  Top 0.254: S2.P$1 72.14,40.64 72.9,39.88 72.9,39.62 73.41,39.12 73.41,37.08 R23.2 73.66,36.83 74.93,36.83 75.44,36.32 76.2,36.32 77.47,37.59 | 77.47,37.59 77.47,38.86 77.98,39.37 77.98,39.88 78.74,40.64 S2.P$2 | 77.47,37.59 77.47,37.08 R25.1 77.47,37.59
N$41
  Top 0.762: D4.P$1 82.8,15.75 82.8,10.67 82.3,10.16 82.3,9.65 J5.P$4 82.3,9.4 82.3,3.56 J5.P$1
N$42
  Top 0.254: S3.P$1 87.12,40.64 87.88,39.88 87.88,39.62 88.39,39.12 88.39,37.08 R24.2 88.65,37.08 92.46,37.08 | 92.46,37.08 92.46,38.86 92.96,39.37 92.96,39.88 93.73,40.64 S3.P$2 | 92.46,37.08 R26.1
VCC  (via drill 0.33)
  Top 0.254: 5.59,23.88 6.1,24.38 10.28,24.38 v12.57,22.1 13.97,21.08 R2.2 | 5.59,23.88 3.56,21.84 3.56,21.34 3.3,21.08 R1.2 | v23.39,22.1 24.89,21.08 R3.2 | v34.8,20.83 36.07,20.83 R4.2 | 5.59,23.88 1.78,27.69 1.78,28.45 2.03,28.7 2.03,30.23 2.29,30.48 2.29,38.86 8.89,45.47 8.89,46.23 SPARK.22
  Bottom 0.254: v12.57,22.1 v23.39,22.1 33.53,22.1 v34.8,20.83
(copper drawn outside any net)
  shapes: Top area x3

### Text on the board
tPlace: https://github.com/engirati/smart-bbq | rev0.1 | smartbbq